# EAGLE design xbee_shield (EAGLE 7.6.0)
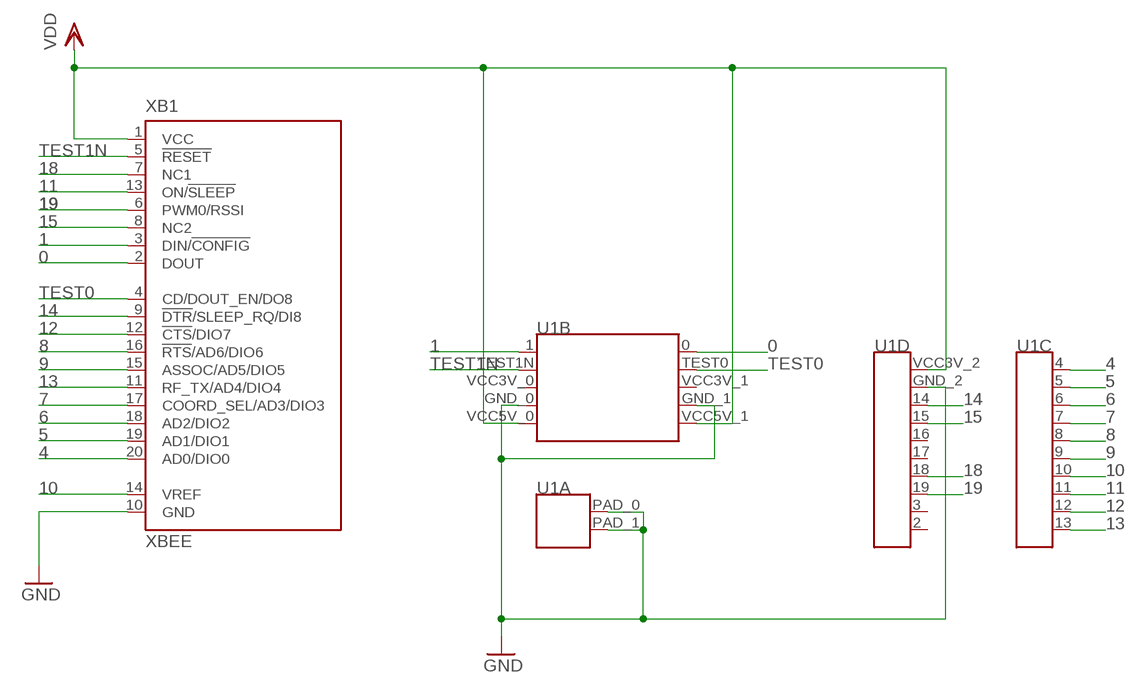
[diagram p0: schematic, sheet 1]

## Parts
U1  LAZURITE920JLAZURITE920J  [LAZURITE920J]
XB1  XBEE  [XBEE]

## Nets
0: U1.0 XB1.2(DOUT)
1: U1.1 XB1.3(DIN/!CONFIG)
4: U1.4 XB1.20(AD0/DIO0)
5: U1.5 XB1.19(AD1/DIO1)
6: U1.6 XB1.18(AD2/DIO2)
7: U1.7 XB1.17(COORD_SEL/AD3/DIO3)
8: U1.8 XB1.16(!RTS!/AD6/DIO6)
9: U1.9 XB1.15(ASSOC/AD5/DIO5)
10: U1.10 XB1.14(VREF)
11: U1.11 XB1.13(ON/!SLEEP)
12: U1.12 XB1.12(!CTS!/DIO7)
13: U1.13 XB1.11(RF_TX/AD4/DIO4)
14: U1.14 XB1.9(!DTR!/SLEEP_RQ/DI8)
15: U1.15 XB1.8(NC2)
18: U1.18 XB1.7(NC1)
19: U1.19 XB1.6(PWM0/RSSI)
GND: U1.GND_0(B:GND_0) U1.GND_1(B:GND_1) U1.GND_2(D:GND_2) U1.PAD_0(A:PAD_0) U1.PAD_1(A:PAD_1) XB1.10(GND)
TEST0: U1.TEST0(B:TEST0) XB1.4(CD/DOUT_EN/DO8)
TEST1N: U1.TEST1N(B:TEST1N) XB1.5(!RESET)
VDD: U1.VCC3V_2(D:VCC3V_2) U1.VCC5V_0(B:VCC5V_0) U1.VCC5V_1(B:VCC5V_1) XB1.1(VCC)
Unconnected: U1.2 U1.3 U1.16 U1.17 U1.VCC3V_0(B:VCC3V_0) U1.VCC3V_1(B:VCC3V_1)

## Library data of the parts
U1 = lazurite:LAZURITE920J: Lazurite 920J
XB1 = lz-shield:XBEE

## Board
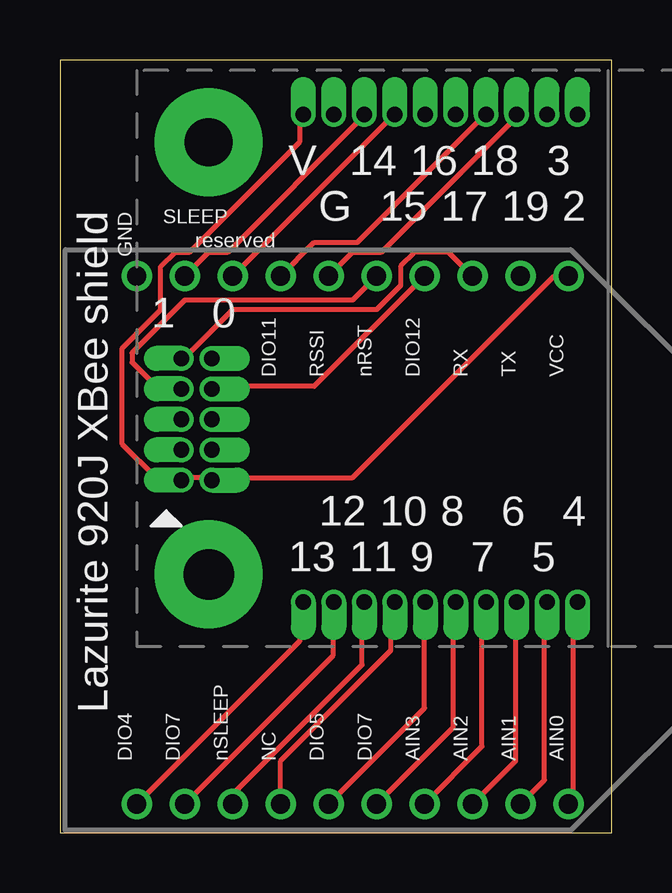
[diagram p1: board, top side]
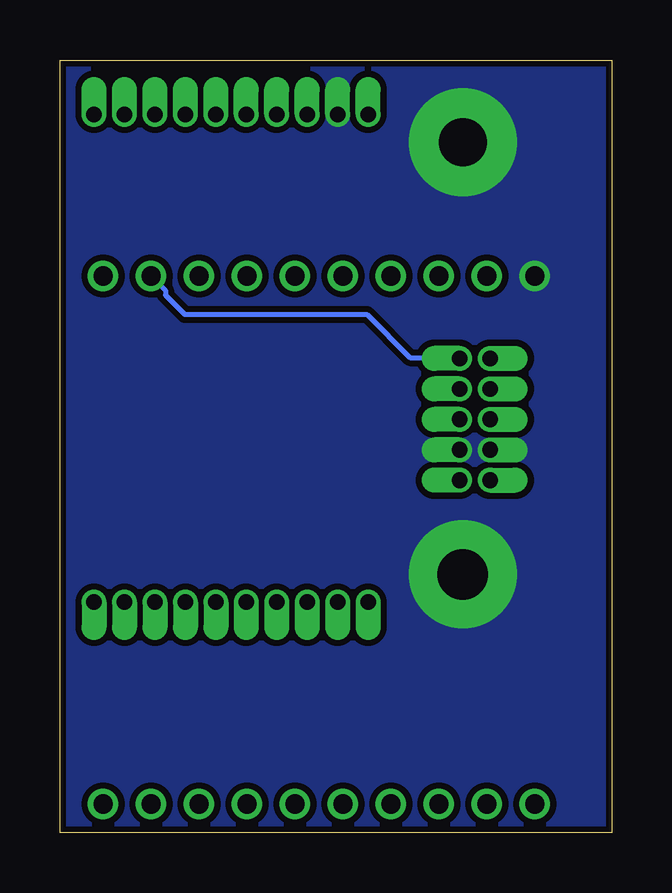
[diagram p2: board, bottom side, seen from below]

Size 23 x 32.2 mm. Coordinates in mm from the lower left corner, seen from the top.
Outline: 0,0 23,0 23,32.2 0,32.2 0,0
Copper layers (1*16): Top 0.07mm / dielectric 1.55mm / Bottom 0.07mm
Design rules "eC_2Layer_PClass4_BaseCopperO70 *": minimum track width 0.2mm, minimum drill 0.35mm, track to track 0.2mm, track to pad 0.2mm, pad to pad 0.2mm, via to via 0.2mm, smd to smd 0mil, copper to edge 0.2mm, drill to drill 0.35mm, minimum pad ring 0.2mm, minimum via ring 0.15mm, stop-mask expansion 0mil, vias tented up to drill 0.45mm, thermal gap 0.2mm

### Footprints (pad centres in the part's own frame; a part is rotated, then mirrored left to right if it is on the bottom)
LAZURITE920J = drill 0.65 pad 0.8 offset: 0 1.27,5.08; 1 0,5.08; 2 16.51,15.24; 3 15.24,15.24; 4 16.51,-5.08; 5 15.24,-5.08; 6 13.97,-5.08; 7 12.7,-5.08; 8 11.43,-5.08; 9 10.16,-5.08; 10 8.89,-5.08; 11 7.62,-5.08; 12 6.35,-5.08; 13 5.08,-5.08; 14 7.62,15.24; 15 8.89,15.24; 16 10.16,15.24; 17 11.43,15.24; 18 12.7,15.24; 19 13.97,15.24; GND_0 0,1.27; GND_1 1.27,1.27; GND_2 6.35,15.24; TEST0 1.27,3.81; TEST1N 0,3.81; VCC3V_0 0,2.54; VCC3V_1 1.27,2.54; VCC3V_2 5.08,15.24; VCC5V_0 0,0; VCC5V_1 1.27,0 | drill 2.1 pad 4.5: PAD_0 1.135,-3.92 | drill 2 pad 4.5: PAD_1 1.135,14.08
XBEE = drill 0.8 pad 1.27: 1 -11,9; 2 -11,7; 3 -11,5; 4 -11,3; 5 -11,1; 6 -11,-1; 7 -11,-3; 8 -11,-5; 9 -11,-7; 10 -11,-9; 11 11,-9; 12 11,-7; 13 11,-5; 14 11,-3; 15 11,-1; 16 11,1; 17 11,3; 18 11,5; 19 11,7; 20 11,9

### Placement (x,y rotation side)
U1  5.07,14.69 0 top
XB1  12.2,12.2 270 top

### Tracks (layer width: path | path; a pad name or v marks a point on that pad's centre or on a via)
0
  Bottom 0.2: XB1.2 18.6,22.6 18.6,22.4 17.8,21.6 10.2,21.6 8.4,19.8 6.4,19.8 U1.0
1
  Top 0.2: XB1.3 16.2,24.2 14.8,24.2 14.2,23.6 14.2,22.8 13.2,21.8 7.2,21.8 5.2,19.8 U1.1
4
  Top 0.2: XB1.20 21.4,1.4 21.4,9.6 U1.4
5
  Top 0.2: XB1.19 20.2,2.2 20.2,9.6 U1.5
6
  Top 0.2: XB1.18 19,3 19,9.6 U1.6
7
  Top 0.2: XB1.17 17.6,3.6 17.6,9.6 U1.7
8
  Top 0.2: XB1.16 16.4,4.4 16.4,9.6 U1.8
9
  Top 0.2: XB1.15 15.2,5.2 15.2,9.6 U1.9
10
  Top 0.2: XB1.14 9.2,3 13.8,7.6 13.8,9.6 U1.10
11
  Top 0.2: XB1.13 7.2,1.6 12.6,7 12.6,9.6 U1.11
12
  Top 0.2: XB1.12 11.4,7.4 11.4,9.6 U1.12
13
  Top 0.2: XB1.11 10,8 10,9.6 U1.13
14
  Top 0.2: XB1.9 6.2,24.2 7,24.2 12.6,29.8 U1.14
15
  Top 0.2: XB1.8 13.8,29.8 U1.15
18
  Top 0.2: XB1.7 10.6,24.6 12.4,24.6 17.6,29.8 U1.18
19
  Top 0.2: XB1.6 12.2,24.2 13.4,24.2 19,29.8 U1.19
GND
  pour Bottom (isolate 0.254, no thermals): 0,0 23,0 23,32.2 0.2,32.2
TEST0
  Top 0.2: XB1.4 10.6,18.6 6.4,18.6 U1.TEST0
TEST1N
  Top 0.2: XB1.5 12.2,22.2 5.2,22.2 3,20 3,19.6 4,18.6 5,18.6 U1.TEST1N
VDD
  Top 0.2: U1.VCC3V_2 10,29.8 10,28.8 5.4,24.2 4.8,24.2 4.2,23.6 4.2,21.8 2.6,20.2 2.6,16.2 4,14.8 5,14.8 U1.VCC5V_0 5.2,14.8 6.2,14.8 U1.VCC5V_1 6.4,14.8 12.2,14.8 20.6,23.2 XB1.1

### Text on the board
tPlace: SLEEP | reserved | GND | DIO11 | RSSI | nRST | DIO12 | RX | TX | VCC | Lazurite 920J XBee shield | DIO4 | DIO7 | nSLEEP | NC | DIO5 | DIO7 | AIN3 | AIN2 | AIN1 | AIN0